# EAGLE schematic bigmuff (EAGLE 9.6.0)
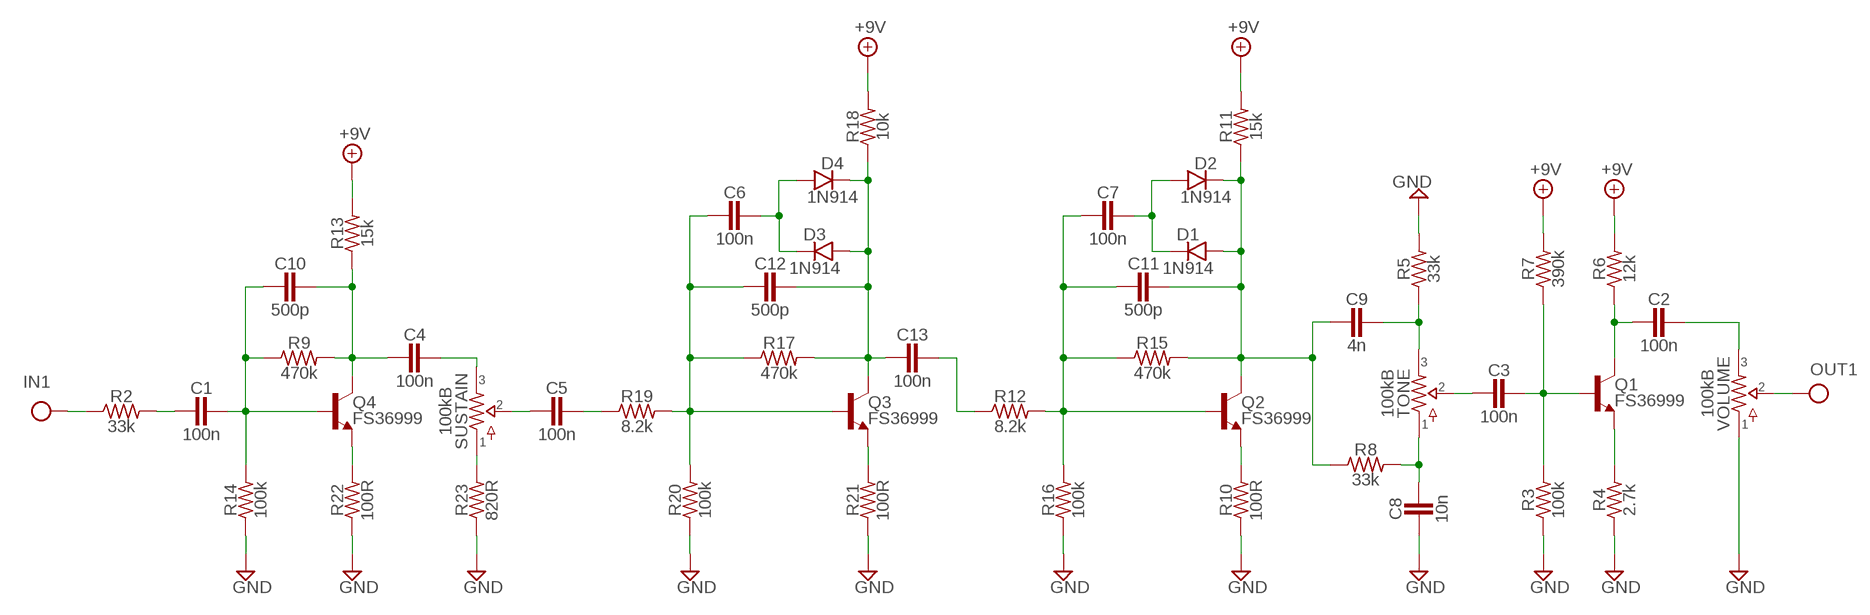
[diagram p0: schematic, sheet 1]

## Parts
C1  100n  CER/FILMBOX.1  [BOX_SMALL]
C2  100n  CER/FILMBOX.1  [BOX_SMALL]
C3  100n  CER/FILMBOX.1  [BOX_SMALL]
C4  100n  CER/FILMBOX.1  [BOX_SMALL]
C5  100n  CER/FILMBOX.1  [BOX_SMALL]
C6  100n  CER/FILMBOX.1  [BOX_SMALL]
C7  100n  CER/FILMBOX.1  [BOX_SMALL]
C8  10n  CER/FILMBOX.1  [BOX_SMALL]
C9  4n  CER/FILMBOX.1  [BOX_SMALL]
C10  500p  CER/FILMBOX.1  [BOX_SMALL]
C11  500p  CER/FILMBOX.1  [BOX_SMALL]
C12  500p  CER/FILMBOX.1  [BOX_SMALL]
C13  100n  CER/FILMBOX.1  [BOX_SMALL]
D1  1N914  DO41.2  [DO41-2]
D2  1N914  DO41.2  [DO41-2]
D3  1N914  DO41.2  [DO41-2]
D4  1N914  DO41.2  [DO41-2]
Q1  FS36999  2N5088  [TO92-]
Q2  FS36999  2N5088  [TO92-]
Q3  FS36999  2N5088  [TO92-]
Q4  FS36999  2N5088  [TO92-]
R2  33k  R_.3B  [R0207/3]
R3  100k  R_.3B  [R0207/3]
R4  2.7k  R_.3B  [R0207/3]
R5  33k  R_.3B  [R0207/3]
R6  12k  R_.3B  [R0207/3]
R7  390k  R_.3B  [R0207/3]
R8  33k  R_.3B  [R0207/3]
R9  470k  R_.3B  [R0207/3]
R10  100R  R_.3B  [R0207/3]
R11  15k  R_.3B  [R0207/3]
R12  8.2k  R_.3B  [R0207/3]
R13  15k  R_.3B  [R0207/3]
R14  100k  R_.3B  [R0207/3]
R15  470k  R_.3B  [R0207/3]
R16  100k  R_.3B  [R0207/3]
R17  470k  R_.3B  [R0207/3]
R18  10k  R_.3B  [R0207/3]
R19  8.2k  R_.3B  [R0207/3]
R20  100k  R_.3B  [R0207/3]
R21  100R  R_.3B  [R0207/3]
R22  100R  R_.3B  [R0207/3]
R23  820R  R_.3B  [R0207/3]
SUSTAIN  100kB  POTS16MM  [16MM]
TONE  100kB  POTS16MM  [16MM]
VOLUME  100kB  POTS16MM  [16MM]

## Nets
+9V: R6.2 R7.2 R11.2 R13.2 R18.2
GND: C8.2 R3.1 R4.1 R5.2 R10.1 R14.1 R16.1 R20.1 R21.1 R22.1 R23.1 VOLUME.1
IN: R2.1
N$2: C1.2 R2.2
N$3: C1.1 C10.2 Q4.2(B) R9.1 R14.2
N$4: Q4.3(E) R22.2
N$5: C4.2 C10.1 Q4.1(C) R9.2 R13.1
N$6: C4.1 SUSTAIN.3
N$7: R23.2 SUSTAIN.1
N$9: C5.2 SUSTAIN.2
N$10: C5.1 R19.1
N$11: C6.2 C12.2 Q3.2(B) R17.1 R19.2 R20.2
N$12: C12.1 C13.2 D3.A D4.C Q3.1(C) R17.2 R18.1
N$13: Q3.3(E) R21.2
N$14: C6.1 D3.C D4.A
N$16: C13.1 R12.1
N$17: C7.2 C11.2 Q2.2(B) R12.2 R15.1 R16.2
N$18: C9.2 C11.1 D1.A D2.C Q2.1(C) R8.1 R11.1 R15.2
N$19: C7.1 D1.C D2.A
N$21: Q2.3(E) R10.2
N$22: C3.2 TONE.2
N$23: C9.1 R5.1 TONE.3
N$24: C8.1 R8.2 TONE.1
N$25: C3.1 Q1.2(B) R3.2 R7.1
N$29: C2.2 Q1.1(C) R6.1
N$30: C2.1 VOLUME.3
N$32: Q1.3(E) R4.2
OUT: VOLUME.2

## Library data of the parts
C1-C13 = pedals-capacitors-film:CER/FILM: 47 - 120pF Xicon Ceramic Disc 2.5mm lead spacing
D1-D4 = pedals-diodes:DO41: DO-41 Package Diodes: 1N4001 - 1N40019 Zener Diodes: 1N4728 - 1N4764
Q1-Q4 = pedals-transistors:2N5088: NPN Transistor
R2-R23 = pedals-resistors:R_
SUSTAIN TONE VOLUME = pedals-potentiometers:POTS